# Altium project WoodStove.PrjPCB (part 2 of 4)

## Sheet InductiveSensor.SchDoc
size Letter
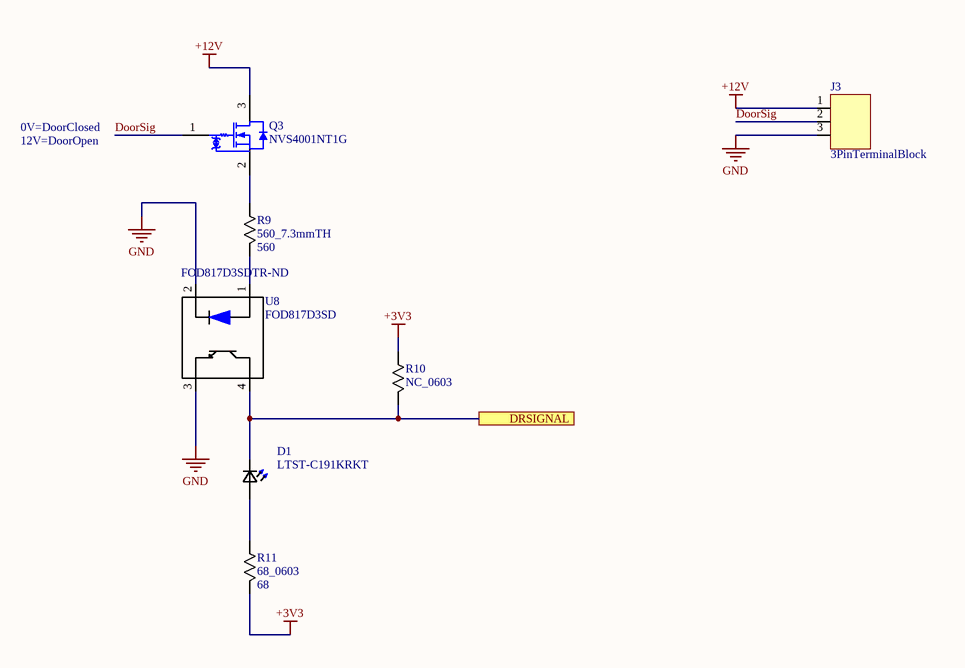
[diagram p2: InductiveSensor.SchDoc]

### Parts
D1  LTST-C191KRKT  [0603]
J3  3PinTerminalBlock  [3 POS 5mm Pitch]
Q3  NVS4001NT1G  [ONSC-SC-70-3-419-04_V]
R9  560_7.3mmTH  Resistance: 560  [7.3mm Through Hole]
R10  NC_0603  [0603]
R11  68_0603  Resistance: 68  [0603]
U8  FOD817D3SD  Supplier Part Number 1: FOD817D3SDTR-ND  [FOD817D3SD]

### Ports
DRSIGNAL

### Nets
+3V3: R10.2 R11.1
+12V: J3.1 Q3.3(D)
GND: J3.3 U8.2(CATHODE) U8.3(EMITER)
DoorSig: J3.2 Q3.1(G)
NetD1_1: D1.1(K2) R10.1 U8.4(COLLECTOR) ; port DRSIGNAL
NetD1_2: D1.2(A2) R11.2
NetQ3_2: Q3.2(S) R9.2
NetR9_1: R9.1 U8.1(ANODE)

### Notes on the sheet
- 0V=DoorClosed
- 12V=DoorOpen

### Library data of the parts
D1 = LTST-C191KRKT: LED; SMD; 0603; red; 18-54mcd; 1.6x0.8x0.55mm; 130Â°; 2Ã·2.4V; 20mA; MF: Lite-On; Package: 0603 Lite-On; MP: LTST-C191KRKT; SnapEDA_Link: https://www.snapeda.com/parts/LTST-C191KRKT/Lite-On/view-part/?ref=snap; Availability: Good; Price: 0.06 USD; Value: *
J3 = 3PinTerminalBlock: 3 Position terminal block
Q3 = NVS4001NT1G: Small Signal MOSFET, 30 V, 270 mA, N-Channel, 3-Pin SC70, Pb-Free, Tape and Reel; Manufacturer: On Semiconductor; Channel Polarity: N Channel; Ciss Typ (pF): 20; Configuration: Single; Coss Typ (pF): 19; Crss Typ (pF): 7.25; ID Max (A): 0.27; PD Max (W): 0.33; V(BR)DSS Min (V): 30; VGS(th) Max (V): 1.5; DatasheetVersion: Rev. 5; PackageVersion: Rev. N, 11/2008; PackageReference: SC-70-3-419-04; PackageDescription: 3-Pin Small Outline Transistor, Body 2 x 1.25 mm, Pitch 0.65 mm; Supplier 1: Newark; Supplier Part Number 1: 60W1862; Supplier 2: Mouser; Supplier Part Number 2: 863-NVS4001NT1G; Package Type: SC-70-3; Packing: Tape and Reel; RoHS: Pb-Free; VGS Max (V): 20; Mounting Technology: Surface Mount; PartNumber: NVS4001NT1G; ComponentLink1Description: Manufacturer URL; ComponentLink1URL: http://www.onsemi.com/; ComponentLink2Description: Datasheet; ComponentLink2URL: http://www.onsemi.cn/pub_link/Collateral/NTS4001N-D.PDF; ComponentLink3Description: Package Specification; ComponentLink3URL: http://www.onsemi.cn/pub_link/Collateral/419-04.PDF
R9 = 560_7.3mmTH: Manufacturer: Stackpole Electronics; Manufacturer Part Number: CFM12JT560R; Tolerance: 5%; Temperature Coefficient: -400ppm/°C; Max Power Dissipation: 500mW; Supplier 1: Digi-Key; Stock 1: 0; Pricing 1: 5000=0.00703, 10000=0.00611, 25000=0.00537, 50000=0.00492, 125000=0.00482 (USD); Mount: Through Hole,Axial; Case/Package: Axial; Contact Plating: Tin,Matte; Min Operating Temperature: -55°C; Max Operating Temperature: 155°C; Package Quantity: 5000; Packaging: Tape and Reel; Composition: Carbon Film; Number of Terminations: 2; Diameter: 2.3mm; Length: 0.256inch; Radiation Hardening: No; Lead Free: Lead Free; ComponentLink1URL: https://www.seielect.com/Catalog/SEI-CF_CFM.pdf; ComponentLink1Description: https://www.seielect.com/Catalog/SEI-CF_CFM.pdf; Supplier Part Number 1: S560HTR-ND
R10 = NC_0603: Resistance: NC
R11 = 68_0603: Manufacturer: Vishay; Manufacturer Part Number: CRCW060368R0FKEA; Tolerance: 1%; Power Rating: 100mW; Voltage Rating: 75V; Temperature Coefficient: 100ppm/°C; Supplier 1: Digi-Key; Stock 1: 0; Pricing 1: 5000=0.00497, 10000=0.00432, 25000=0.00405 (USD); Case/Package: 0603; Weight: 7.1E-05oz; Case Code (Metric): 1608; Case Code (Imperial): 0603; Contact Plating: Tin; Min Operating Temperature: -55°C; Max Operating Temperature: 155°C; Composition: Thick Film; Packaging: Tape and Reel; Voltage Rating (DC): 75V; Package Quantity: 10; Number of Terminations: 2; Termination: SMD/SMT; Max Power Dissipation: 100mW; Military Standard: Not; Length: 1.55mm; Height: 0.45mm; Width: 0.033inch; Depth: 0.85mm; Radiation Hardening: No; REACH SVHC: Unknown; Lead Free: Lead Free; ComponentLink1URL: https://datasheet.ciiva.com/2494/dcrcwe3-2494368.pdf; ComponentLink1Description: https://datasheet.ciiva.com/2494/dcrcwe3-2494368.pdf; ComponentLink2URL: https://datasheet.ciiva.com/11809/0900766b80d98afc-11809013.pdf; ComponentLink2Description: https://datasheet.ciiva.com/11809/0900766b80d98afc-11809013.pdf; ComponentLink3URL: https://datasheet.ciiva.com/8337/dcrcwe3-8337350.pdf; ComponentLink3Description: https://datasheet.ciiva.com/8337/dcrcwe3-8337350.pdf; ComponentLink4URL: https://datasheet.ciiva.com/7777/1697337-7777608.pdf; ComponentLink4Description: https://datasheet.ciiva.com/7777/1697337-7777608.pdf; ComponentLink5URL: https://datasheet.ciiva.com/16770/70201119-16770904.pdf; ComponentLink5Description: https://datasheet.ciiva.com/16770/70201119-16770904.pdf; ComponentLink6URL: https://datasheet.ciiva.com/2494/dcrcwe3-2494366.pdf; ComponentLink6Description: https://datasheet.ciiva.com/2494/dcrcwe3-2494366.pdf; ComponentLink7URL: https://datasheet.ciiva.com/22870/70201119-22870302.pdf; ComponentLink7Description: https://datasheet.ciiva.com/22870/70201119-22870302.pdf; ComponentLink8URL: https://datasheet.ciiva.com/2494/dcrcwe3-2494367.pdf; ComponentLink8Description: https://datasheet.ciiva.com/2494/dcrcwe3-2494367.pdf; ComponentLink9URL: https://datasheet.ciiva.com/16200/dcrcw-16200591.pdf; ComponentLink9Description: https://datasheet.ciiva.com/16200/dcrcw-16200591.pdf; Supplier Part Number 1: 541-68.0HTR-ND
U8 = FOD817D3SD: OPTOISOLATOR 5KV TRANSISTOR 4SMD 20mA/1.2V saturation; Manufacturer: ON Semiconductor / Fairchild; Max Power Dissipation: 200mW; Collector Emitter Voltage (VCEO): 200mV; Max Input Current: 50mA; Rise Time: 18000ns; Number of Channels: 1; Forward Voltage: 1.4V; Reverse Breakdown Voltage: 6V; Output Voltage: 70V; Current Transfer Ratio: 600%; Supplier 1: Digi-Key; Manufacturer Part Number: FOD817D3SD; Stock 1: 123000; Pricing 1: 1000=0.15939, 2000=0.14611, 5000=0.13283, 10000=0.12397, 25000=0.11954, 50000=0.11512 (USD); Mount: Surface Mount; Case/Package: SMD/SMT; Number of Pins: 4; Weight: 0g; Min Operating Temperature: -55°C; Max Operating Temperature: 110°C; Collector Emitter Saturation Voltage: 200mV; Package Quantity: 1; Packaging: Tape and Reel; Forward Current: 50mA; Max Output Voltage: 70V; Output Current per Channel: 50mA; Max Collector Current: 50mA; Isolation Voltage: 5kV; Fall Time: 18000ns; Number of Elements: 1; Power Dissipation: 200mW; Input Current: 50mA; Number of Circuits: 1; Radiation Hardening: No; REACH SVHC: No SVHC; Lead Free: Lead Free; ComponentLink1URL: https://datasheet.ciiva.com/25620/0900766b810e24fa-25620565.pdf; ComponentLink1Description: https://datasheet.ciiva.com/25620/0900766b810e24fa-25620565.pdf; ComponentLink2URL: https://datasheet.ciiva.com/26122/fod817d-26122105.pdf; ComponentLink2Description: https://datasheet.ciiva.com/26122/fod817d-26122105.pdf; ComponentLink3URL: https://datasheet.ciiva.com/15118/getdatasheetpartid-67082-15118458.pdf; ComponentLink3Description: https://datasheet.ciiva.com/15118/getdatasheetpartid-67082-15118458.pdf; ComponentLink4URL: https://datasheet.ciiva.com/2086/fod817d-2086155.pdf; ComponentLink4Description: https://datasheet.ciiva.com/2086/fod817d-2086155.pdf; ComponentLink5URL: https://datasheet.ciiva.com/46433/1563587-46433595.pdf; ComponentLink5Description: https://datasheet.ciiva.com/46433/1563587-46433595.pdf; ComponentLink6URL: https://datasheet.ciiva.com/2086/fod817d-2086156.pdf; ComponentLink6Description: https://datasheet.ciiva.com/2086/fod817d-2086156.pdf; ComponentLink7URL: https://datasheet.ciiva.com/2086/fod817d-2086157.pdf; ComponentLink7Description: https://datasheet.ciiva.com/2086/fod817d-2086157.pdf; ComponentLink8URL: https://datasheet.ciiva.com/8095/fod817d-8095549.pdf; ComponentLink8Description: https://datasheet.ciiva.com/8095/fod817d-8095549.pdf; ComponentLink9URL: https://datasheet.ciiva.com/4701/fod817d-4701711.pdf; ComponentLink9Description: https://datasheet.ciiva.com/4701/fod817d-4701711.pdf; ComponentLink10URL: https://datasheet.ciiva.com/17001/fod817-17001647.pdf; ComponentLink10Description: https://datasheet.ciiva.com/17001/fod817-17001647.pdf

## Sheet LightRelay.SchDoc
size Letter
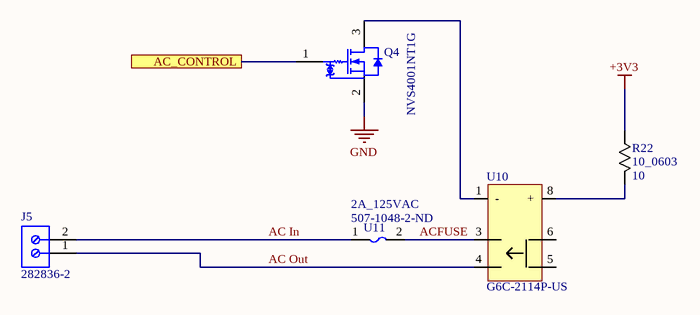
[diagram p3: LightRelay.SchDoc]

### Parts
J5  282836-2  [TECO-282836-2_V]
Q4  NVS4001NT1G  [ONSC-SC-70-3-419-04_V]
R22  10_0603  Resistance: 10  [0603]
U10  G6C-2114P-US  [G6C-2114P-US]
U11  2A_125VAC  Supplier Part Number 1: 507-1048-2-ND  [2410]

### Ports
AC_CONTROL

### Nets
+3V3: R22.2
GND: Q4.2(S)
AC In: J5.2 U11.1
AC Out: J5.1 U10.4
ACFUSE: U10.3 U11.2
NetQ4_1: Q4.1(G) ; port AC_CONTROL
NetQ4_3: Q4.3(D) U10.1(-)
NetR22_1: R22.1 U10.8(+)

Not connected (* = marked no-connect by the designer): U10 5 6

### Library data of the parts
J5 = 282836-2: Female Header, Pitch 5 mm, 1 x 2 Position, Height 10 mm, Tail Length 3.5 mm, Rohs, Bulk; Current: 13.5A; Clamp Material - Plating: Brass - Nickel Plated; Dynamic Catalog: Buchanan Series; Positions Per Level: 2; Wire Termination: Screw - Rising Cage Clamp; Other Names: 5ULV-02B / A98076; Screw Thread: M3; Number of Levels: 1; Wire Gauge: 16-30 AWG; Product Training Modules: Wire-to-Board Eurostyle Terminal Blocks; Mating Orientation: Horizontal with Board; 3D Model: 282836-2.pdf; Featured Product: Eurostyle Terminal Block Connectors; Pitch: 0.197" (5.00mm); Voltage: 300V; Torque - Screw: 0.68 Nm (6 Lb-In); PackageReference: THD; PackageDescription: Female Header, Pitch 5 mm, 1 x 2 Position, Height 10 mm, Tail Length 3.5 mm; Supplier 1: Newark; Supplier Part Number 1: 23C9697; Supplier 2: Farnell; Supplier Part Number 2: 3089034; Supplier 3: Digi-Key; Supplier Part Number 3: A98076-ND; Features: Interlocking (Side); Color: Green; Packaging: Bulk; Family: Terminal Blocks - Wire to Board; Housing Material: Polyamide (PA66), Nylon 6/6; RoHS Information: 282836-2 Statement of Compliance; Mounting Type: Through Hole; Series: Buchanan; Standard Package: 300; Contact Material - Plating: Brass - Tin Plated; Category: Connectors, Interconnects; Screw Material - Plating: Brass - Nickel Plated; ComponentLink1Description: Manufacturer URL; ComponentLink1URL: http://www.te.com; ComponentLink2Description: Datasheet; ComponentLink2URL: http://www.te.com.cn/commerce/DocumentDelivery/DDEController?Action=showdoc&DocId=Catalog+Section%7F1308389_EUROSTYLE_TERMINAL_BLOCKS%7F0607%7Fpdf%7FEnglish%7FENG_CS_1308389_EUROSTYLE_TERMINAL_BLOCKS_0607.pdf%7F282836-2
Q4 = NVS4001NT1G: as Q3 on sheet InductiveSensor; DatasheetVersion: Rev. 5; PackageVersion: Rev. N, 11/2008; PackageReference: SC-70-3-419-04; PackageDescription: 3-Pin Small Outline Transistor, Body 2 x 1.25 mm, Pitch 0.65 mm; Supplier 1: Newark; Supplier Part Number 1: 60W1862; Supplier 2: Mouser; Supplier Part Number 2: 863-NVS4001NT1G; Package Type: SC-70-3; Packing: Tape and Reel; RoHS: Pb-Free; VGS Max (V): 20; Mounting Technology: Surface Mount; PartNumber: NVS4001NT1G; ComponentLink1Description: Manufacturer URL; ComponentLink1URL: http://www.onsemi.com/; ComponentLink2Description: Datasheet; ComponentLink2URL: http://www.onsemi.cn/pub_link/Collateral/NTS4001N-D.PDF; ComponentLink3Description: Package Specification; ComponentLink3URL: http://www.onsemi.cn/pub_link/Collateral/419-04.PDF
R22 = 10_0603: Manufacturer: Vishay; Manufacturer Part Number: CRCW060310R0FKEA; Tolerance: 1%; Power Rating: 100mW; Voltage Rating: 75V; Temperature Coefficient: 100ppm/°C; Supplier 1: Digi-Key; Stock 1: 0; Pricing 1: 5000=0.00497, 10000=0.00432, 25000=0.00405 (USD); Mount: Surface Mount; Case/Package: 0603; Number of Pins: 2; Weight: 7.1E-05oz; Case Code (Metric): 1608; Case Code (Imperial): 0603; Contact Plating: Tin; Min Operating Temperature: -55°C; Max Operating Temperature: 155°C; Packaging: Tape and Reel; Termination: SMD/SMT; Military Standard: Not; Composition: Thick Film; Voltage Rating (DC): 75V; Package Quantity: 10; Number of Terminations: 2; Max Power Dissipation: 100mW; Length: 1.55mm; Height: 0.45mm; Width: 0.033inch; Depth: 0.85mm; REACH SVHC: Unknown; Lead Free: Lead Free; ComponentLink1URL: https://datasheet.ciiva.com/2465/dcrcwe3-2465699.pdf; ComponentLink1Description: https://datasheet.ciiva.com/2465/dcrcwe3-2465699.pdf; ComponentLink2URL: https://datasheet.ciiva.com/2465/dcrcwe3-2465700.pdf; ComponentLink2Description: https://datasheet.ciiva.com/2465/dcrcwe3-2465700.pdf; ComponentLink3URL: https://datasheet.ciiva.com/11808/0900766b80d98afc-11808660.pdf; ComponentLink3Description: https://datasheet.ciiva.com/11808/0900766b80d98afc-11808660.pdf; ComponentLink4URL: https://datasheet.ciiva.com/2465/dcrcwe3-2465701.pdf; ComponentLink4Description: https://datasheet.ciiva.com/2465/dcrcwe3-2465701.pdf; ComponentLink5URL: https://datasheet.ciiva.com/16740/dcrcwe3-16740661.pdf; ComponentLink5Description: https://datasheet.ciiva.com/16740/dcrcwe3-16740661.pdf; ComponentLink6URL: https://datasheet.ciiva.com/26316/fld-crcw-e3-data-en-26316582.pdf; ComponentLink6Description: https://datasheet.ciiva.com/26316/fld-crcw-e3-data-en-26316582.pdf; ComponentLink7URL: https://datasheet.ciiva.com/16781/70201119-16781847.pdf; ComponentLink7Description: https://datasheet.ciiva.com/16781/70201119-16781847.pdf; ComponentLink8URL: https://datasheet.ciiva.com/3256/dcrcwe3-3256955.pdf; ComponentLink8Description: https://datasheet.ciiva.com/3256/dcrcwe3-3256955.pdf; ComponentLink9URL: https://datasheet.ciiva.com/5547/dcrcwe3-109170-5547342.pdf; ComponentLink9Description: https://datasheet.ciiva.com/5547/dcrcwe3-109170-5547342.pdf; ComponentLink10URL: https://datasheet.ciiva.com/22673/1697337-22673071.pdf; ComponentLink10Description: https://datasheet.ciiva.com/22673/1697337-22673071.pdf; Supplier Part Number 1: 541-10.0HTR-ND
U10 = G6C-2114P-US: RELAY GENERAL PURPOSE DPST 8A 3V 67mA coil drive 45ohm coil resistance
U11 = 2A_125VAC: Manufacturer: Bel; Manufacturer Part Number: SSQ2; Voltage Rating (AC): 125V; Current Rating: 2A; DC Cold Resistance: 39mR; Fuse Type: Board Mount (Cartridge Style Excluded); Approvals: CSA,CE,cULus; Supplier 1: Digi-Key; Stock 1: 59000; Pricing 1: 1000=0.15908, 2000=0.14847, 3000=0.14582, 5000=0.14317, 10000=0.13787 (USD); Mount: Surface Mount; Case/Package: SMD/SMT; Min Operating Temperature: -55°C; Max Operating Temperature: 125°C; Voltage Rating (DC): 125V; Packaging: Tape and Reel; Length: 0.24inch; Height: 0.1inch; Width: 0.1inch; ComponentLink1URL: https://datasheet.ciiva.com/300/ssq-300722.pdf; ComponentLink1Description: https://datasheet.ciiva.com/300/ssq-300722.pdf; ComponentLink2URL: https://datasheet.ciiva.com/300/ssq-300723.pdf; ComponentLink2Description: https://datasheet.ciiva.com/300/ssq-300723.pdf; ComponentLink3URL: https://datasheet.ciiva.com/300/ssq-300724.pdf; ComponentLink3Description: https://datasheet.ciiva.com/300/ssq-300724.pdf

## Sheet PressureSensor.SchDoc
size Letter
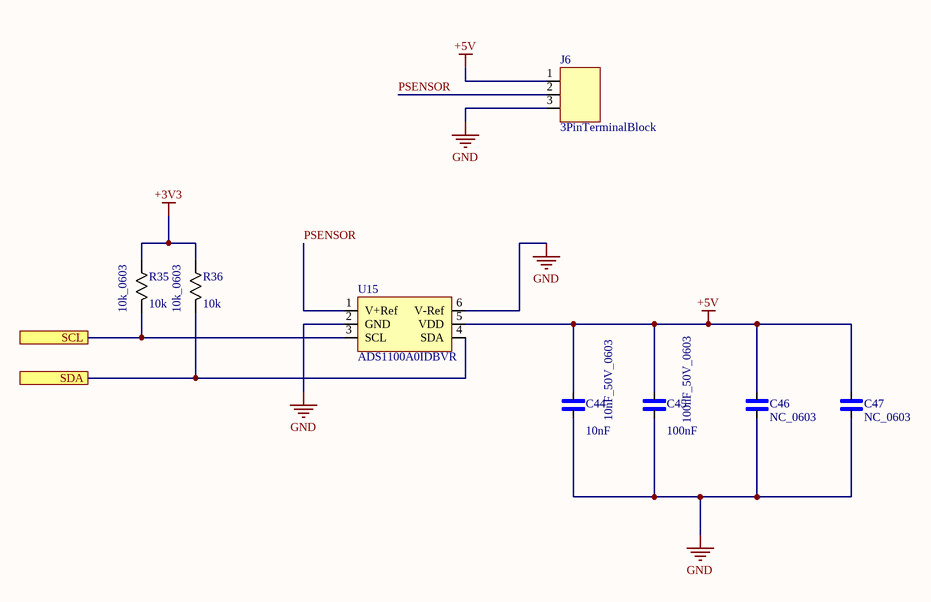
[diagram p4: PressureSensor.SchDoc]

### Parts
C44  10nF_50V_0603  Capacitance: 10nF  [0603]
C45  100nF_50V_0603  Capacitance: 100nF  [0603]
C46  NC_0603  [0603]
C47  NC_0603  [0603]
J6  3PinTerminalBlock  [3 POS 5mm Pitch]
R35  10k_0603  Resistance: 10k  [0603]
R36  10k_0603  Resistance: 10k  [0603]
U15  ADS1100A0IDBVR  [ADS1100A0IDBVR]

### Ports
SCL, SDA

### Nets
+3V3: R35.2 R36.2
+5V: C44.2 C45.2 C46.2 C47.2 J6.1 U15.5(VDD)
GND: C44.1 C45.1 C46.1 C47.1 J6.3 U15.2(GND) U15.6(V-Ref)
PSENSOR: J6.2 U15.1(V+Ref)
NetR35_1: R35.1 U15.3(SCL) ; port SCL
NetR36_1: R36.1 U15.4(SDA) ; port SDA

### Library data of the parts
C44 = 10nF_50V_0603: Manufacturer: Murata; Manufacturer Part Number: GRM188R71H103KA01D; Dielectric Material: Ceramic; Voltage Rating: 50V; Tolerance: 10%; Dielectric: X7R; Insulation Resistance: 10GR; Supplier 1: Digi-Key; Stock 1: 0; Pricing 1: 1=0.1, 10=0.06, 100=0.0266, 500=0.019 (USD); Mount: Surface Mount; Case/Package: 0603; Number of Pins: 2; Case Code (Metric): 1608; Case Code (Imperial): 0603; Material: Ceramic; Min Operating Temperature: -55°C; Max Operating Temperature: 125°C; Packaging: Tape and Reel; Voltage Rating (DC): 50V; Package Quantity: 1; Termination: SMD/SMT; Voltage: 50V; Length: 1.6mm; Height: 0.8mm; Width: 0.031inch; Thickness: 0.035inch; Depth: 0.8mm; REACH SVHC: Unknown; Lead Free: Lead Free; ComponentLink1URL: https://datasheet.ciiva.com/129/product-129872.pdf; ComponentLink1Description: https://datasheet.ciiva.com/129/product-129872.pdf; ComponentLink2URL: https://datasheet.ciiva.com/11786/0900766b8003061f-11786516.pdf; ComponentLink2Description: https://datasheet.ciiva.com/11786/0900766b8003061f-11786516.pdf; ComponentLink3URL: https://datasheet.ciiva.com/7937/4360-7937654.pdf; ComponentLink3Description: https://datasheet.ciiva.com/7937/4360-7937654.pdf; ComponentLink4URL: https://datasheet.ciiva.com/7937/1747461-7937655.pdf; ComponentLink4Description: https://datasheet.ciiva.com/7937/1747461-7937655.pdf; ComponentLink5URL: https://datasheet.ciiva.com/7937/1747461-7937656.pdf; ComponentLink5Description: https://datasheet.ciiva.com/7937/1747461-7937656.pdf; ComponentLink6URL: https://datasheet.ciiva.com/28534/1769893-28534235.pdf; ComponentLink6Description: https://datasheet.ciiva.com/28534/1769893-28534235.pdf; ComponentLink7URL: https://datasheet.ciiva.com/129/partnumbering-e-01-129870.pdf; ComponentLink7Description: https://datasheet.ciiva.com/129/partnumbering-e-01-129870.pdf; ComponentLink8URL: https://datasheet.ciiva.com/48428/nmgrm-data-en-48428590.pdf; ComponentLink8Description: https://datasheet.ciiva.com/48428/nmgrm-data-en-48428590.pdf; ComponentLink9URL: https://datasheet.ciiva.com/129/partnumbering-e-01-129871.pdf; ComponentLink9Description: https://datasheet.ciiva.com/129/partnumbering-e-01-129871.pdf; ComponentLink10URL: https://datasheet.ciiva.com/48428/nmgrm-data-en-48428591.pdf; ComponentLink10Description: https://datasheet.ciiva.com/48428/nmgrm-data-en-48428591.pdf; ComponentLink11URL: https://datasheet.ciiva.com/29202/451715-da-01-en-vs-kondensator-0603-29202047.pdf; ComponentLink11Description: https://datasheet.ciiva.com/29202/451715-da-01-en-vs-kondensator-0603-29202047.pdf; Supplier Part Number 1: 490-1512-1-ND
C45 = 100nF_50V_0603: Manufacturer: Murata; Manufacturer Part Number: GRM188R71H104KA93D; Material: Ceramic; Tolerance: 10%; Voltage Rating: 50V; Dielectric: X7R; Insulation Resistance: 10GR; Supplier 1: Digi-Key; Stock 1: 0; Pricing 1: 1=0.12, 10=0.084, 100=0.0396, 500=0.02778, 1000=0.023 (USD); Mount: Surface Mount; Case/Package: 0603; Number of Pins: 2; Case Code (Imperial): 0603; Case Code (Metric): 1608; Dielectric Material: Ceramic; Contact Plating: Tin,Matte; Min Operating Temperature: -55°C; Max Operating Temperature: 125°C; Packaging: Tape and Reel; Voltage Rating (DC): 50V; Package Quantity: 1; Termination: SMD/SMT; Voltage: 50V; Length: 1.6mm; Height: 0.8mm; Width: 0.8mm; Thickness: 0.035inch; Depth: 0.8mm; Radiation Hardening: No; REACH SVHC: No SVHC; Lead Free: Lead Free; ComponentLink1URL: https://datasheet.ciiva.com/19467/1857604-19467681.pdf; ComponentLink1Description: https://datasheet.ciiva.com/19467/1857604-19467681.pdf; ComponentLink2URL: https://datasheet.ciiva.com/28534/4360-28534245.pdf; ComponentLink2Description: https://datasheet.ciiva.com/28534/4360-28534245.pdf; ComponentLink3URL: https://datasheet.ciiva.com/26915/getdatasheetpartid-89095-26915384.pdf; ComponentLink3Description: https://datasheet.ciiva.com/26915/getdatasheetpartid-89095-26915384.pdf; ComponentLink4URL: https://datasheet.ciiva.com/131/partnumbering-e-01-131738.pdf; ComponentLink4Description: https://datasheet.ciiva.com/131/partnumbering-e-01-131738.pdf; ComponentLink5URL: https://datasheet.ciiva.com/7937/1747470-7937658.pdf; ComponentLink5Description: https://datasheet.ciiva.com/7937/1747470-7937658.pdf; ComponentLink6URL: https://datasheet.ciiva.com/14116/nmgrm-data-en-14116602.pdf; ComponentLink6Description: https://datasheet.ciiva.com/14116/nmgrm-data-en-14116602.pdf; ComponentLink7URL: https://datasheet.ciiva.com/131/partnumbering-e-01-131739.pdf; ComponentLink7Description: https://datasheet.ciiva.com/131/partnumbering-e-01-131739.pdf; ComponentLink8URL: https://datasheet.ciiva.com/7937/4360-7937659.pdf; ComponentLink8Description: https://datasheet.ciiva.com/7937/4360-7937659.pdf; ComponentLink9URL: https://datasheet.ciiva.com/48436/nmgrm-data-en-48436667.pdf; ComponentLink9Description: https://datasheet.ciiva.com/48436/nmgrm-data-en-48436667.pdf; ComponentLink10URL: https://datasheet.ciiva.com/131/partnumbering-e-01-131740.pdf; ComponentLink10Description: https://datasheet.ciiva.com/131/partnumbering-e-01-131740.pdf; ComponentLink11URL: https://datasheet.ciiva.com/11786/0900766b807a1cab-11786047.pdf; ComponentLink11Description: https://datasheet.ciiva.com/11786/0900766b807a1cab-11786047.pdf; ComponentLink12URL: https://datasheet.ciiva.com/29201/451744-da-01-en-vs-kondensator-0603-29201904.pdf; ComponentLink12Description: https://datasheet.ciiva.com/29201/451744-da-01-en-vs-kondensator-0603-29201904.pdf; Supplier Part Number 1: 490-1519-6-ND
J6 = 3PinTerminalBlock: 3 Position terminal block
R35 R36 = 10k_0603: Manufacturer: Panasonic; Manufacturer Part Number: ERJ-3EKF1002V; Tolerance: 1%; Max Power Dissipation: 100mW; Temperature Coefficient: 100ppm/°C; Voltage Rating: 75V; Supplier 1: Digi-Key; Stock 1: 0; Pricing 1: 5000=0.00751, 10000=0.00653, 25000=0.00573, 50000=0.00526, 125000=0.00515 (USD); Mount: Surface Mount; Case/Package: 0603; Number of Pins: 2; Case Code (Metric): 1608; Case Code (Imperial): 0603; Contact Plating: Tin; Min Operating Temperature: -55°C; Max Operating Temperature: 155°C; Packaging: Tape and Reel; Power Rating: 100mW; Package Quantity: 1; Termination: SMD/SMT; Composition: Thick Film; Number of Terminations: 2; Military Standard: Not; Voltage Rating (DC): 75V; Length: 1.6mm; Height: 0.45mm; Depth: 0.8mm; Width: 0.031inch; Radiation Hardening: No; Lead Free: Lead Free; REACH SVHC: No SVHC; ComponentLink1URL: https://datasheet.ciiva.com/16511/aoa0000ce2-16511861.pdf; ComponentLink1Description: https://datasheet.ciiva.com/16511/aoa0000ce2-16511861.pdf; ComponentLink2URL: https://datasheet.ciiva.com/46372/1678782-46372725.pdf; ComponentLink2Description: https://datasheet.ciiva.com/46372/1678782-46372725.pdf; ComponentLink3URL: https://datasheet.ciiva.com/28514/426256-28514198.pdf; ComponentLink3Description: https://datasheet.ciiva.com/28514/426256-28514198.pdf; ComponentLink4URL: https://datasheet.ciiva.com/9194/aoa0000ce2-9194199.pdf; ComponentLink4Description: https://datasheet.ciiva.com/9194/aoa0000ce2-9194199.pdf; ComponentLink5URL: https://datasheet.ciiva.com/7830/aoa0000ce2-7830729.pdf; ComponentLink5Description: https://datasheet.ciiva.com/7830/aoa0000ce2-7830729.pdf; ComponentLink6URL: https://datasheet.ciiva.com/17212/aoa0000ce2-17212105.pdf; ComponentLink6Description: https://datasheet.ciiva.com/17212/aoa0000ce2-17212105.pdf; ComponentLink7URL: https://datasheet.ciiva.com/30208/aoa0000ce2-30208985.pdf; ComponentLink7Description: https://datasheet.ciiva.com/30208/aoa0000ce2-30208985.pdf; ComponentLink8URL: https://datasheet.ciiva.com/48530/aoa0000ce2-48530988.pdf; ComponentLink8Description: https://datasheet.ciiva.com/48530/aoa0000ce2-48530988.pdf; ComponentLink9URL: https://datasheet.ciiva.com/24070/aoa0000ce2-24070318.pdf; ComponentLink9Description: https://datasheet.ciiva.com/24070/aoa0000ce2-24070318.pdf; ComponentLink10URL: https://datasheet.ciiva.com/16759/70260748-16759807.pdf; ComponentLink10Description: https://datasheet.ciiva.com/16759/70260748-16759807.pdf; Supplier Part Number 1: P10.0KHTR-ND
U15 = ADS1100A0IDBVR: Self-Calibrating, 16-Bit Analog-to-Digital Converter 6-SOT-23 -40 to 85

## Sheet FanPWM.SchDoc
size Letter
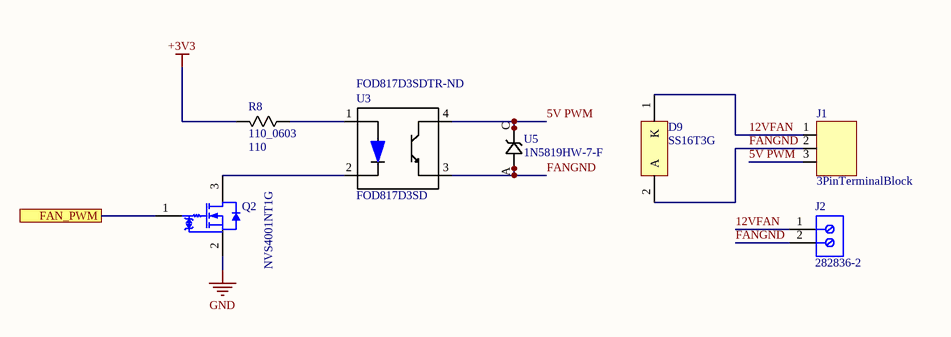
[diagram p5: FanPWM.SchDoc]

### Parts
D9  SS16T3G  [ONSC-SMA-2-403D-02_V]
J1  3PinTerminalBlock  [3 POS 5mm Pitch]
J2  282836-2  [TECO-282836-2_V]
Q2  NVS4001NT1G  [ONSC-SC-70-3-419-04_V]
R8  110_0603  Resistance: 110  [0603]
U3  FOD817D3SD  Supplier Part Number 1: FOD817D3SDTR-ND  [FOD817D3SD]
U5  1N5819HW-7-F  [1N5819HW-7-F]

### Ports
FAN_PWM

### Nets
+3V3: R8.1
GND: Q2.2(S)
5V PWM: J1.3 U3.4(COLLECTOR) U5.C
12VFAN: D9.1(K) J1.1 J2.1
FANGND: D9.2(A) J1.2 J2.2 U3.3(EMITER) U5.A
NetQ2_1: Q2.1(G) ; port FAN_PWM
NetQ2_3: Q2.3(D) U3.2(CATHODE)
NetR8_2: R8.2 U3.1(ANODE)

### Library data of the parts
D9 = SS16T3G: Schottky Power Rectifier, 2-Pin SMA, Pb-Free, Tape and Reel; Manufacturer: On Semiconductor; Configuration: Single; IFSM Max (A): 40; DatasheetVersion: Rev. 7; PackageVersion: Rev. G, 07/2012; PackageReference: SMA-2-403D-02; PackageDescription: 2-Pin Small Molded Package, J-Bend Lead, Body 2.605 x 4.315 mm; Supplier 1: Digi-Key; Supplier Part Number 1: SS16T3GOSTR-ND; Supplier 2: Digi-Key; Supplier Part Number 2: SS16T3GOSCT-ND; Supplier 3: Digi-Key; Supplier Part Number 3: SS16T3GOSDKR-ND; Supplier 4: Farnell; Supplier Part Number 4: 2317421; Supplier 5: Farnell; Supplier Part Number 5: 1900107; Supplier 6: Newark; Supplier Part Number 6: 98H0976; Supplier 7: Newark; Supplier Part Number 7: 10N9613; Supplier 8: Mouser; Supplier Part Number 8: 863-SS16T3G; Packing: Tape and Reel; RoHS: TRUE; Mounting Technology: Surface Mount; PartNumber: SS16T3G; ComponentLink1Description: Manufacturer URL; ComponentLink1URL: http://www.onsemi.com/; ComponentLink2Description: Datasheet; ComponentLink2URL: http://www.onsemi.cn/pub_link/Collateral/SS16-D.PDF; ComponentLink3Description: Package Specification; ComponentLink3URL: http://www.onsemi.com/pub_link/Collateral/403D-02.PDF
J1 = 3PinTerminalBlock: 3 Position terminal block
J2 = 282836-2: as J5 on sheet LightRelay; PackageReference: THD; PackageDescription: Female Header, Pitch 5 mm, 1 x 2 Position, Height 10 mm, Tail Length 3.5 mm; Supplier 1: Newark; Supplier Part Number 1: 23C9697; Supplier 2: Farnell; Supplier Part Number 2: 3089034; Supplier 3: Digi-Key; Supplier Part Number 3: A98076-ND; Features: Interlocking (Side); Color: Green; Packaging: Bulk; Family: Terminal Blocks - Wire to Board; Housing Material: Polyamide (PA66), Nylon 6/6; RoHS Information: 282836-2 Statement of Compliance; Mounting Type: Through Hole; Series: Buchanan; Standard Package: 300; Contact Material - Plating: Brass - Tin Plated; Category: Connectors, Interconnects; Screw Material - Plating: Brass - Nickel Plated; ComponentLink1Description: Manufacturer URL; ComponentLink1URL: http://www.te.com; ComponentLink2Description: Datasheet; ComponentLink2URL: http://www.te.com.cn/commerce/DocumentDelivery/DDEController?Action=showdoc&DocId=Catalog+Section%7F1308389_EUROSTYLE_TERMINAL_BLOCKS%7F0607%7Fpdf%7FEnglish%7FENG_CS_1308389_EUROSTYLE_TERMINAL_BLOCKS_0607.pdf%7F282836-2
Q2 = NVS4001NT1G: as Q3 on sheet InductiveSensor; DatasheetVersion: Rev. 5; PackageVersion: Rev. N, 11/2008; PackageReference: SC-70-3-419-04; PackageDescription: 3-Pin Small Outline Transistor, Body 2 x 1.25 mm, Pitch 0.65 mm; Supplier 1: Newark; Supplier Part Number 1: 60W1862; Supplier 2: Mouser; Supplier Part Number 2: 863-NVS4001NT1G; Package Type: SC-70-3; Packing: Tape and Reel; RoHS: Pb-Free; VGS Max (V): 20; Mounting Technology: Surface Mount; PartNumber: NVS4001NT1G; ComponentLink1Description: Manufacturer URL; ComponentLink1URL: http://www.onsemi.com/; ComponentLink2Description: Datasheet; ComponentLink2URL: http://www.onsemi.cn/pub_link/Collateral/NTS4001N-D.PDF; ComponentLink3Description: Package Specification; ComponentLink3URL: http://www.onsemi.cn/pub_link/Collateral/419-04.PDF
R8 = 110_0603: Manufacturer: Vishay; Manufacturer Part Number: CRCW0603110RFKEA; Power Rating: 100mW; Tolerance: 1%; Voltage Rating: 75V; Temperature Coefficient: 100ppm/°C; Supplier 1: Digi-Key; Stock 1: 35000; Pricing 1: 5000=0.00497, 10000=0.00432, 25000=0.00405 (USD); Mount: Surface Mount; Case/Package: 0603; Number of Pins: 2; Weight: 7.1E-05oz; Case Code (Metric): 1608; Case Code (Imperial): 0603; Contact Plating: Tin; Min Operating Temperature: -55°C; Max Operating Temperature: 155°C; Composition: Thick Film; Packaging: Tape and Reel; Voltage Rating (DC): 75V; Package Quantity: 10; Number of Terminations: 2; Military Standard: Not; Max Power Dissipation: 100mW; Termination: SMD/SMT; Length: 1.55mm; Height: 0.45mm; Width: 0.033inch; Depth: 0.85mm; Radiation Hardening: No; REACH SVHC: Unknown; Lead Free: Lead Free; ComponentLink1URL: https://datasheet.ciiva.com/11809/0900766b80d98afc-11809778.pdf; ComponentLink1Description: https://datasheet.ciiva.com/11809/0900766b80d98afc-11809778.pdf; ComponentLink2URL: https://datasheet.ciiva.com/2525/dcrcwe3-2525299.pdf; ComponentLink2Description: https://datasheet.ciiva.com/2525/dcrcwe3-2525299.pdf; ComponentLink3URL: https://datasheet.ciiva.com/2525/dcrcwe3-2525300.pdf; ComponentLink3Description: https://datasheet.ciiva.com/2525/dcrcwe3-2525300.pdf; ComponentLink4URL: https://datasheet.ciiva.com/2525/dcrcwe3-2525301.pdf; ComponentLink4Description: https://datasheet.ciiva.com/2525/dcrcwe3-2525301.pdf; ComponentLink5URL: https://datasheet.ciiva.com/7822/1697337-7822981.pdf; ComponentLink5Description: https://datasheet.ciiva.com/7822/1697337-7822981.pdf; ComponentLink6URL: https://datasheet.ciiva.com/16758/70201119-16758821.pdf; ComponentLink6Description: https://datasheet.ciiva.com/16758/70201119-16758821.pdf; ComponentLink7URL: https://datasheet.ciiva.com/3256/dcrcwe3-3256966.pdf; ComponentLink7Description: https://datasheet.ciiva.com/3256/dcrcwe3-3256966.pdf; ComponentLink8URL: https://datasheet.ciiva.com/7822/1697337-7822982.pdf; ComponentLink8Description: https://datasheet.ciiva.com/7822/1697337-7822982.pdf; ComponentLink9URL: https://datasheet.ciiva.com/3256/dcrcwe3-3256967.pdf; ComponentLink9Description: https://datasheet.ciiva.com/3256/dcrcwe3-3256967.pdf; ComponentLink10URL: https://datasheet.ciiva.com/26316/fld-crcw-e3-data-en-26316567.pdf; ComponentLink10Description: https://datasheet.ciiva.com/26316/fld-crcw-e3-data-en-26316567.pdf; ComponentLink11URL: https://datasheet.ciiva.com/16787/70201119-16787496.pdf; ComponentLink11Description: https://datasheet.ciiva.com/16787/70201119-16787496.pdf; ComponentLink12URL: https://datasheet.ciiva.com/7792/125364-7792010.pdf; ComponentLink12Description: https://datasheet.ciiva.com/7792/125364-7792010.pdf; ComponentLink13URL: https://datasheet.ciiva.com/16885/dcrcwe3-16885194.pdf; ComponentLink13Description: https://datasheet.ciiva.com/16885/dcrcwe3-16885194.pdf; ComponentLink14URL: https://datasheet.ciiva.com/22674/1912744-22674701.pdf; ComponentLink14Description: https://datasheet.ciiva.com/22674/1912744-22674701.pdf; ComponentLink15URL: https://datasheet.ciiva.com/22707/1697337-22707342.pdf; ComponentLink15Description: https://datasheet.ciiva.com/22707/1697337-22707342.pdf; Supplier Part Number 1: 541-110HTR-ND
U3 = FOD817D3SD: as U8 on sheet InductiveSensor; Supplier 1: Digi-Key; Manufacturer Part Number: FOD817D3SD; Stock 1: 123000; Pricing 1: 1000=0.15939, 2000=0.14611, 5000=0.13283, 10000=0.12397, 25000=0.11954, 50000=0.11512 (USD); Mount: Surface Mount; Case/Package: SMD/SMT; Number of Pins: 4; Weight: 0g; Min Operating Temperature: -55°C; Max Operating Temperature: 110°C; Collector Emitter Saturation Voltage: 200mV; Package Quantity: 1; Packaging: Tape and Reel; Forward Current: 50mA; Max Output Voltage: 70V; Output Current per Channel: 50mA; Max Collector Current: 50mA; Isolation Voltage: 5kV; Fall Time: 18000ns; Number of Elements: 1; Power Dissipation: 200mW; Input Current: 50mA; Number of Circuits: 1; Radiation Hardening: No; REACH SVHC: No SVHC; Lead Free: Lead Free; ComponentLink1URL: https://datasheet.ciiva.com/25620/0900766b810e24fa-25620565.pdf; ComponentLink1Description: https://datasheet.ciiva.com/25620/0900766b810e24fa-25620565.pdf; ComponentLink2URL: https://datasheet.ciiva.com/26122/fod817d-26122105.pdf; ComponentLink2Description: https://datasheet.ciiva.com/26122/fod817d-26122105.pdf; ComponentLink3URL: https://datasheet.ciiva.com/15118/getdatasheetpartid-67082-15118458.pdf; ComponentLink3Description: https://datasheet.ciiva.com/15118/getdatasheetpartid-67082-15118458.pdf; ComponentLink4URL: https://datasheet.ciiva.com/2086/fod817d-2086155.pdf; ComponentLink4Description: https://datasheet.ciiva.com/2086/fod817d-2086155.pdf; ComponentLink5URL: https://datasheet.ciiva.com/46433/1563587-46433595.pdf; ComponentLink5Description: https://datasheet.ciiva.com/46433/1563587-46433595.pdf; ComponentLink6URL: https://datasheet.ciiva.com/2086/fod817d-2086156.pdf; ComponentLink6Description: https://datasheet.ciiva.com/2086/fod817d-2086156.pdf; ComponentLink7URL: https://datasheet.ciiva.com/2086/fod817d-2086157.pdf; ComponentLink7Description: https://datasheet.ciiva.com/2086/fod817d-2086157.pdf; ComponentLink8URL: https://datasheet.ciiva.com/8095/fod817d-8095549.pdf; ComponentLink8Description: https://datasheet.ciiva.com/8095/fod817d-8095549.pdf; ComponentLink9URL: https://datasheet.ciiva.com/4701/fod817d-4701711.pdf; ComponentLink9Description: https://datasheet.ciiva.com/4701/fod817d-4701711.pdf; ComponentLink10URL: https://datasheet.ciiva.com/17001/fod817-17001647.pdf; ComponentLink10Description: https://datasheet.ciiva.com/17001/fod817-17001647.pdf
U5 = 1N5819HW-7-F: DIODE SCHOTTKY 40V 1A SOD123

## Sheet USB.SchDoc
size Letter
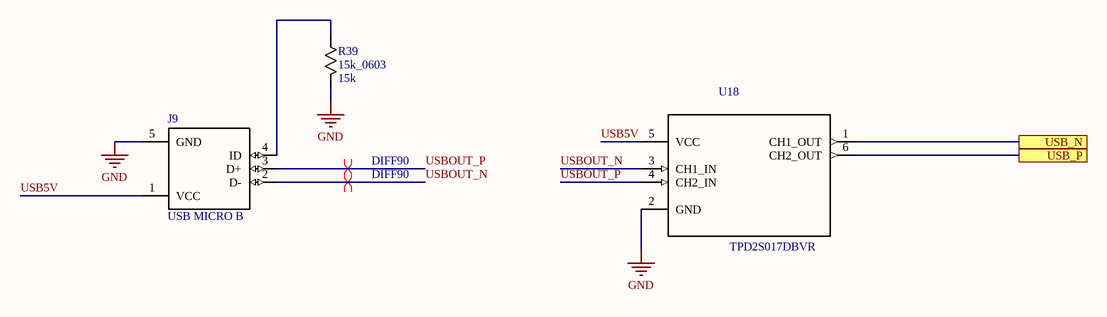
[diagram p6: USB.SchDoc]

### Parts
J9  USB MICRO B  [10103594-0001LF]
R39  15k_0603  Resistance: 15k  [0603]
U18  TPD2S017DBVR  [SOT95P280X145-6N]

### Ports
USB_N, USB_P

### Nets
GND: J9.5(GND) R39.1 U18.2(GND)
USB5V: J9.1(VCC) U18.5(VCC)
USB_N: U18.1(CH1_OUT) ; port USB_N
USB_P: U18.6(CH2_OUT) ; port USB_P
USBOUT_N: J9.2(D-) U18.3(CH1_IN)
USBOUT_P: J9.3(D+) U18.4(CH2_IN)
NetJ9_4: J9.4(ID) R39.2

### Layout directives
differential pair; differential pair class DIFF90; net class USBOCLASS: USBOUT_N, USBOUT_P

### Library data of the parts
J9 = 10103594-0001LF
R39 = 15k_0603: Manufacturer: Panasonic; Manufacturer Part Number: ERJ-3EKF1502V; Tolerance: 1%; Temperature Coefficient: 100ppm/°C; Max Power Dissipation: 100mW; Voltage Rating (DC): 75V; Supplier 1: Digi-Key; Stock 1: 0; Pricing 1: 5000=0.00751, 10000=0.00653, 25000=0.00573, 50000=0.00526, 125000=0.00515 (USD); Mount: Surface Mount; Case/Package: 0603; Number of Pins: 2; Case Code (Metric): 1608; Case Code (Imperial): 0603; Contact Plating: Tin; Min Operating Temperature: -55°C; Max Operating Temperature: 155°C; Packaging: Tape and Reel; Composition: Thick Film; Power Rating: 100mW; Number of Terminations: 2; Package Quantity: 1; Military Standard: Not; Termination: SMD/SMT; Voltage Rating: 75V; Length: 1.6mm; Height: 0.022inch; Width: 0.031inch; Depth: 0.8mm; Radiation Hardening: No; Lead Free: Lead Free; REACH SVHC: No SVHC; ComponentLink1URL: https://datasheet.ciiva.com/16770/70260748-16770997.pdf; ComponentLink1Description: https://datasheet.ciiva.com/16770/70260748-16770997.pdf; ComponentLink2URL: https://datasheet.ciiva.com/7830/426256-7830982.pdf; ComponentLink2Description: https://datasheet.ciiva.com/7830/426256-7830982.pdf; ComponentLink3URL: https://datasheet.ciiva.com/24026/aoa0000ce2-24026054.pdf; ComponentLink3Description: https://datasheet.ciiva.com/24026/aoa0000ce2-24026054.pdf; ComponentLink4URL: https://datasheet.ciiva.com/6138/aoa0000ce2-6138183.pdf; ComponentLink4Description: https://datasheet.ciiva.com/6138/aoa0000ce2-6138183.pdf; ComponentLink5URL: https://datasheet.ciiva.com/48530/aoa0000ce2-48530983.pdf; ComponentLink5Description: https://datasheet.ciiva.com/48530/aoa0000ce2-48530983.pdf; ComponentLink6URL: https://datasheet.ciiva.com/9193/aoa0000ce2-9193001.pdf; ComponentLink6Description: https://datasheet.ciiva.com/9193/aoa0000ce2-9193001.pdf; ComponentLink7URL: https://datasheet.ciiva.com/16762/70260748-16762729.pdf; ComponentLink7Description: https://datasheet.ciiva.com/16762/70260748-16762729.pdf; ComponentLink8URL: https://datasheet.ciiva.com/22722/426256-22722779.pdf; ComponentLink8Description: https://datasheet.ciiva.com/22722/426256-22722779.pdf; ComponentLink9URL: https://datasheet.ciiva.com/7830/aoa0000ce2-7830732.pdf; ComponentLink9Description: https://datasheet.ciiva.com/7830/aoa0000ce2-7830732.pdf; ComponentLink10URL: https://datasheet.ciiva.com/46372/1678782-46372846.pdf; ComponentLink10Description: https://datasheet.ciiva.com/46372/1678782-46372846.pdf; ComponentLink11URL: https://datasheet.ciiva.com/46372/1678782-46372847.pdf; ComponentLink11Description: https://datasheet.ciiva.com/46372/1678782-46372847.pdf; Supplier Part Number 1: P15.0KHTR-ND
U18 = TPD2S017DBVR: 2-Channel Ultra Low Clamp Voltage ESD Solution with Series-Resistor Isolation 6-SOT-23 -40 to 85; MF: Texas Instruments; Price: 0.32 USD; MP: TPD2S017DBVR; SnapEDA_Link: https://www.snapeda.com/parts/TPD2S017DBVR/Texas%20Instruments/view-part/?ref=snap; Availability: Good; Package: SOT-23-6 Texas Instruments; Value: *